# EAGLE design breakout_v2 (EAGLE 7.7.0)
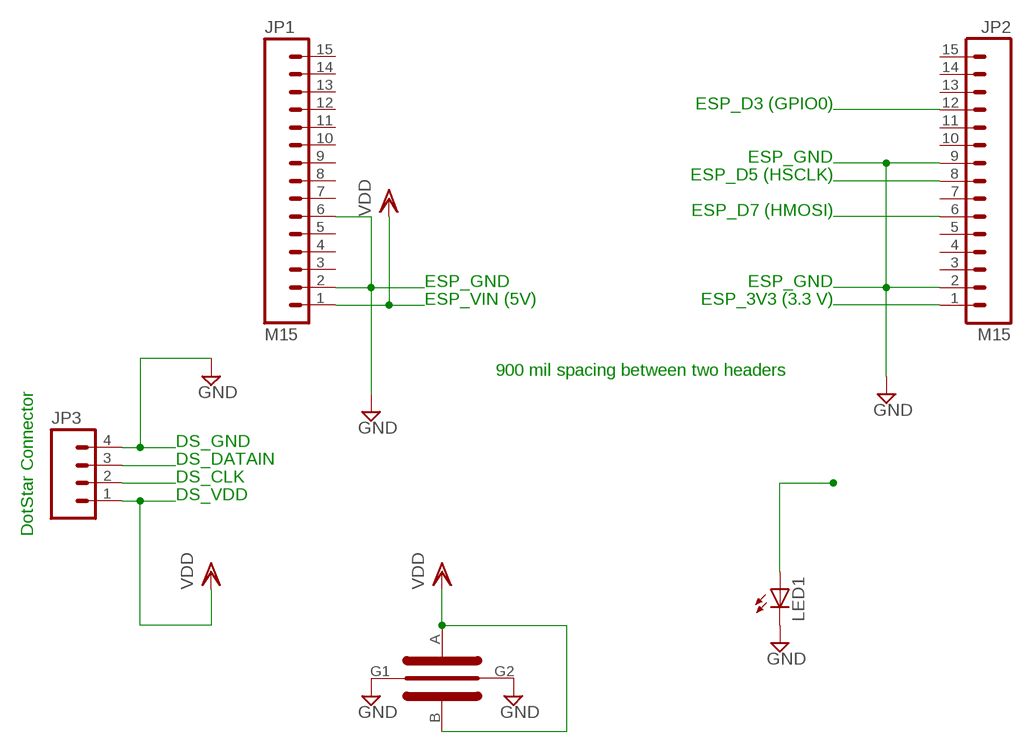
[diagram p0: schematic, sheet 1]

## Parts
JP1  M15  [1X15]
JP2  M15  [1X15]
JP3  M04PTH  [1X04]
LED1  LED5MM  [LED5MM]
U$1  X2Y_CAP  [0603(X14)]

## Nets
DS_CLK: JP2.8 JP3.2
DS_DATAIN: JP2.6 JP3.3
GND: JP1.2 JP1.6 JP2.2 JP2.9 JP3.4 LED1.K(C) U$1.G1 U$1.G2
LED_PIN: JP2.12 LED1.A
N$2: JP2.1
VDD: JP1.1 JP3.1 U$1.A U$1.B
Unconnected: JP1.3 JP1.4 JP1.5 JP1.7 JP1.8 JP1.9 JP1.10 JP1.11 JP1.12 JP1.13 JP1.14 JP1.15 JP2.3 JP2.4 JP2.5 JP2.7 JP2.10 JP2.11 JP2.13 JP2.14 JP2.15

## Notes on the sheet
- ESP_D3 (GPIO0)
- ESP_GND
- ESP_D5 (HSCLK)
- ESP_D7 (HMOSI)
- ESP_GND | ESP_GND
- ESP_VIN (5V) | ESP_3V3 (3.3 V)
- 900 mil spacing between two headers
- DS_GND
- DS_DATAIN
- DS_CLK
- DS_VDD
- DotStar Connector

## Library data of the parts
JP1 JP2 = SparkFun-Connectors:M15: Header 15 Standard 15-pin 0.1" header. Use with straight break away headers (SKU : PRT-00116), right angle break away headers (PRT-00553), swiss pins (PRT-00743), machine pins (PRT-00117), and female headers (PRT-00115).
JP3 = SparkFun-Connectors:M04: Header 4 Standard 4-pin 0.1" header. Use with straight break away headers (SKU : PRT-00116), right angle break away headers (PRT-00553), swiss pins (PRT-00743), machine pins (PRT-00117), and female headers (PRT-00115). Molex polarized connector foot print use with SKU : PRT-08231 with associated crimp pins and housings. 1MM SMD Version SKU: PRT-10208
LED1 = led:LED: LED OSRAM: - CHIPLED LG R971, LG N971, LY N971, LG Q971, LY Q971, LO R971, LY R971 LH N974, LH R974 LS Q976, LO Q976, LY Q976 LO Q996 - Hyper CHIPLED LW Q18S LB Q993, LB Q99A, LB R99A - SideLED LS A670, LO A670, LY A670, LG A670, LP A670 LB A673, LV A673, LT A673, LW A673 LH A674 LY A675 LS A676, LA A676, LO A676, LY A676, LW A676 LS A679, LY A679, LG A679 - Hyper Micro SIDELED® LS Y876, LA Y876, LO Y876, LY Y876 LT Y87S - SmartLED LW L88C, LW L88S LB L89C, LB L89S, LG L890 LS L89K, LO L89K, LY L89K LS L896, LA L896, LO L896, LY L896 - TOPLED LS T670, LO T670, LY T670, LG T670, LP T670 LSG T670, LSP T670, LSY T670, LOP T670, LYG T670 LG T671, LOG T671, LSG T671 LB T673, LV T673, LT T673, LW T673 LH T674 LS T676, LA T676, LO T676, LY T676, LB T676, LH T676, LSB T676, LW T676 LB T67C, LV T67C, LT T67C, LS T67K, LO T67K, LY T67K, LW E67C LS E67B, LA E67B, LO E67B, LY E67B, LB E67C, LV E67C, LT E67C LW T67C LS T679, LY T679, LG T679 LS T770, LO T770, LY T770, LG T770, LP T770 LB T773, LV T773, LT T773, LW T773 LH T774 LS E675, LA E675, LY E675, LS T675 LS T776, LA T776, LO T776, LY T776, LB T776 LHGB T686 LT T68C, LB T68C - Hyper Mini TOPLED® LB M676 - Mini TOPLED Santana® LG M470 LS M47K, LO M47K, LY M47K Source: http://www.osram.convergy.de LUXEON: - LUMILED® LXK2-PW12-R00, LXK2-PW12-S00, LXK2-PW14-U00, LXK2-PW14-V00 LXK2-PM12-R00, LXK2-PM12-S00, LXK2-PM14-U00 LXK2-PE12-Q00, LXK2-PE12-R00, LXK2-PE12-S00, LXK2-PE14-T00, LXK2-PE14-U00 LXK2-PB12-K00, LXK2-PB12-L00, LXK2-PB12-M00, LXK2-PB14-N00, LXK2-PB14-P00, LXK2-PB14-Q00 LXK2-PR12-L00, LXK2-PR12-M00, LXK2-PR14-Q00, LXK2-PR14-R00 LXK2-PD12-Q00, LXK2-PD12-R00, LXK2-PD12-S00 LXK2-PH12-R00, LXK2-PH12-S00 LXK2-PL12-P00, LXK2-PL12-Q00, LXK2-PL12-R00 Source: www.luxeon.com KINGBRIGHT: KA-3528ASYC Source: www.kingbright.com
U$1 = mylib:X2Y_CAP

## Board
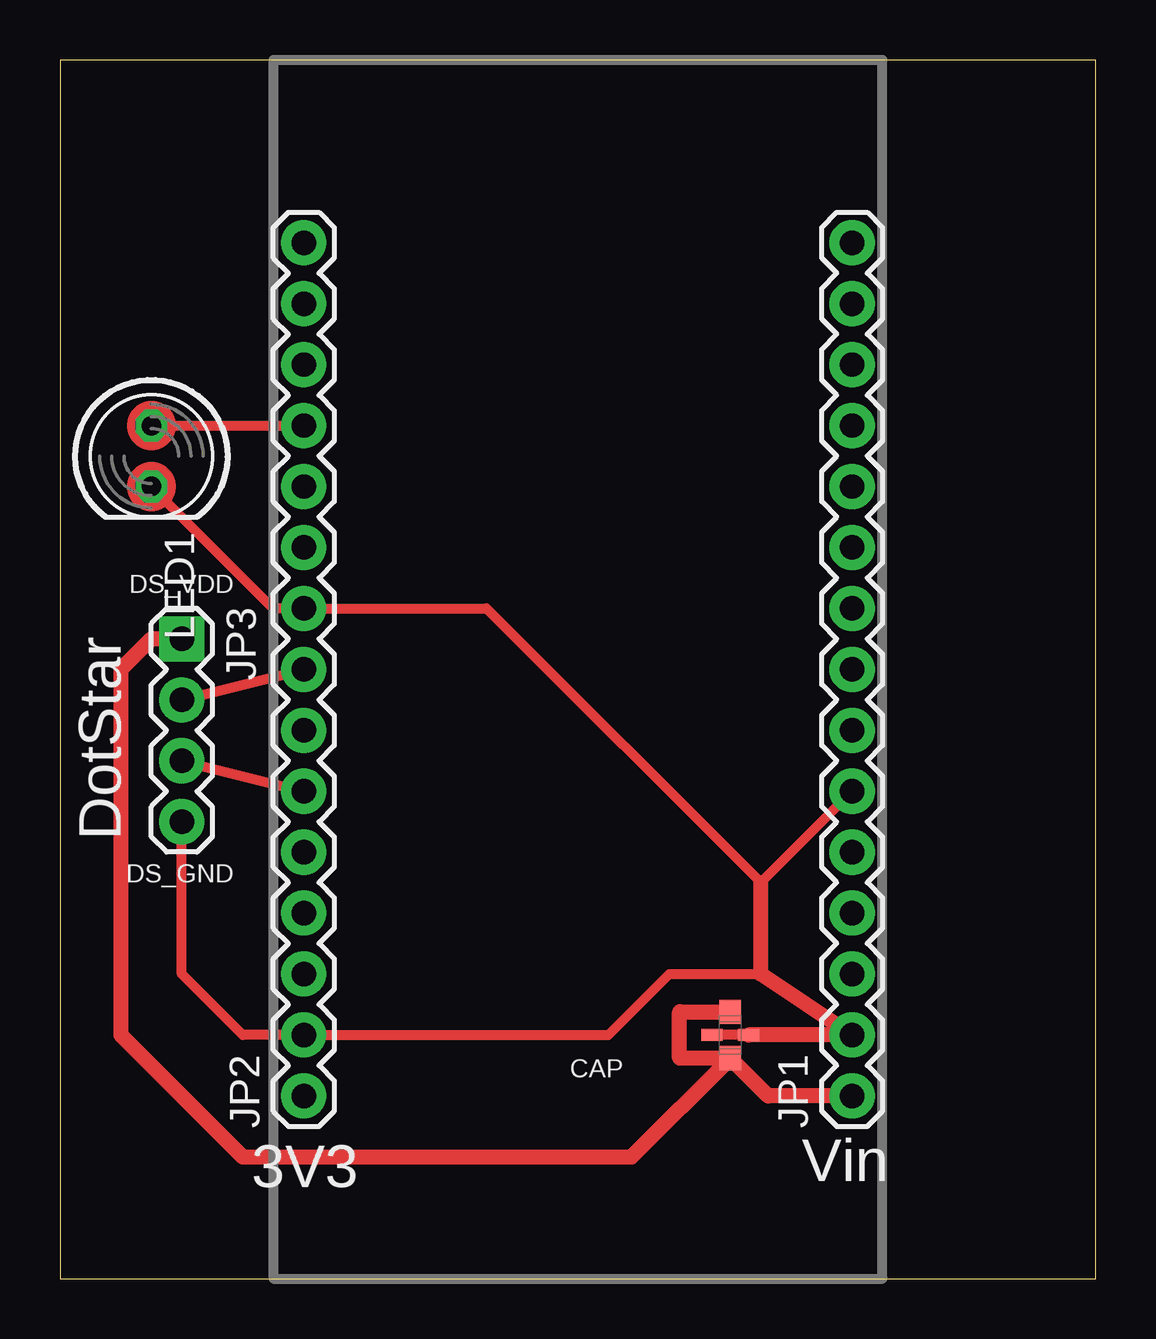
[diagram p1: board, top side]

Size 43.18 x 50.8 mm. Coordinates in mm from the lower left corner, seen from the top.
Outline: 0,0 43.18,0 43.18,50.8 0,50.8 0,0
Copper layers (1*16): Top 0.035mm / dielectric 1.5mm / Bottom 0.035mm
Design rules "default": minimum track width 10mil, minimum drill 24mil, track to track 8mil, track to pad 8mil, pad to pad 8mil, via to via 8mil, smd to smd 8mil, copper to edge 40mil, drill to drill 8mil, minimum pad ring 10mil, minimum via ring 8mil, stop-mask expansion 4mil, vias tented up to drill 0mil, thermal gap 10mil

### Footprints (pad centres in the part's own frame; a part is rotated, then mirrored left to right if it is on the bottom)
1X15 = drill 1.016 pad 1.88: 1 0,0; 2 2.54,0; 3 5.08,0; 4 7.62,0; 5 10.16,0; 6 12.7,0; 7 15.24,0; 8 17.78,0; 9 20.32,0; 10 22.86,0; 11 25.4,0; 12 27.94,0; 13 30.48,0; 14 33.02,0; 15 35.56,0
1X04 = drill 1.016 pad 1.88 square: 1 0,0 | drill 1.016 pad 1.88: 2 2.54,0; 3 5.08,0; 4 7.62,0
LED5MM = drill 0.813 octagon: A -1.27,0; K 1.27,0
0603(X14) = smd 1.016 x 0.889: A -0.965,0; B 0.965,0 | smd 0.508 x 0.889: G1 0,-0.762; G2 0,0.762

### Placement (x,y rotation side)
JP1  33.02,7.62 90 top
JP2  10.16,7.62 90 top
JP3  5.08,26.67 270 top
LED1  3.81,34.29 270 top
U$1  27.94,10.16 270 top

### Tracks (layer width: path | path; a pad name or v marks a point on that pad's centre or on a via)
DS_CLK
  Top 0.406: JP3.2 JP2.8
DS_DATAIN
  Top 0.406: JP3.3 JP2.6
GND
  Top 0.406: U$1.G2 U$1.G1 | JP3.4 5.08,12.7 7.62,10.16 JP2.2 22.86,10.16 25.4,12.7 29.21,12.7 | LED1.K 8.89,27.94 JP2.9 17.78,27.94 29.21,16.51 JP1.6
  Top 0.635: U$1.G2 JP1.2 29.21,12.7 29.21,16.51
LED_PIN
  Top 0.406: LED1.A JP2.12
VDD
  Top 0.635: JP1.1 29.52,7.62 U$1.B | U$1.B 25.83,9.2 25.83,11.12 U$1.A | JP3.1 3.81,26.67 2.54,25.4 2.54,10.16 7.62,5.08 23.82,5.08 U$1.B
(copper drawn outside any net)
  shapes: Top circle x2

### Text on the board
tNames: DS_VDD | DotStar | DS_GND | CAP | 3V3 | Vin